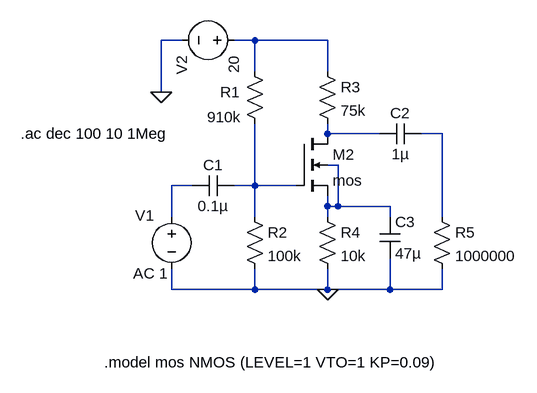
[diagram p0: schematic NNM24EE049_Jeethesh.asc]
NNM24EE049_Jeethesh.asc, the LTspice schematic file:
Version 4.1
SHEET 1 964 680
WIRE 16 -80 -16 -80
WIRE 128 -80 96 -80
WIRE 240 -80 128 -80
WIRE 128 -32 128 -80
WIRE 240 -32 240 -80
WIRE -16 0 -16 -80
WIRE 240 64 240 48
WIRE 320 64 240 64
WIRE 416 64 384 64
WIRE 256 112 240 112
WIRE 32 144 0 144
WIRE 128 144 128 48
WIRE 128 144 96 144
WIRE 192 144 128 144
WIRE 240 176 240 160
WIRE 256 176 256 112
WIRE 256 176 240 176
WIRE 336 176 256 176
WIRE 0 192 0 144
WIRE 128 192 128 144
WIRE 240 192 240 176
WIRE 336 192 336 176
WIRE 416 192 416 64
WIRE 0 304 0 272
WIRE 128 304 128 272
WIRE 128 304 0 304
WIRE 240 304 240 272
WIRE 240 304 128 304
WIRE 336 304 336 256
WIRE 336 304 240 304
WIRE 416 304 416 272
WIRE 416 304 336 304
FLAG 240 304 0
FLAG -16 0 0
SYMBOL res 112 -48 R0
WINDOW 0 -37 48 Left 2
WINDOW 3 -57 86 Left 2
SYMATTR InstName R1
SYMATTR Value 910k
SYMBOL res 112 176 R0
SYMATTR InstName R2
SYMATTR Value 100k
SYMBOL res 224 -48 R0
SYMATTR InstName R3
SYMATTR Value 75k
SYMBOL res 224 176 R0
SYMATTR InstName R4
SYMATTR Value 10k
SYMBOL res 400 176 R0
SYMATTR InstName R5
SYMATTR Value 1000000
SYMBOL cap 96 128 R90
WINDOW 0 0 32 VBottom 2
WINDOW 3 32 32 VTop 2
SYMATTR InstName C1
SYMATTR Value 0.1µ
SYMBOL cap 320 80 R270
WINDOW 0 32 32 VTop 2
WINDOW 3 0 32 VBottom 2
SYMATTR InstName C2
SYMATTR Value 1µ
SYMBOL voltage 0 176 R0
WINDOW 0 -56 14 Left 2
WINDOW 3 -200 106 Left 2
WINDOW 123 -59 103 Left 2
WINDOW 39 0 0 Left 0
SYMATTR InstName V1
SYMATTR Value ""
SYMATTR Value2 AC 1
SYMBOL voltage 112 -80 R90
WINDOW 0 24 96 Left 2
WINDOW 3 24 16 Left 2
WINDOW 123 0 0 Left 0
WINDOW 39 0 0 Left 0
SYMATTR InstName V2
SYMATTR Value 20
SYMBOL cap 320 192 R0
SYMATTR InstName C3
SYMATTR Value 47µ
SYMBOL nmos4 192 64 R0
SYMATTR InstName M2
SYMATTR Value mos
TEXT -232 64 Left 2 !.ac dec 100 10 1Meg
TEXT -104 416 Left 2 !.model mos NMOS (LEVEL=1 VTO=1 KP=0.09)

The netlist it stands for:
* NNM24EE049_Jeethesh.asc
R1 N001 N006 910k
R2 N006 0 100k
R3 N001 N002 75k
R4 N004 0 10k
R5 N003 0 1000000
C1 N006 N005 0.1µ
C2 N002 N003 1µ
V1 N005 0 AC 1
V2 N001 0 20
C3 N004 0 47µ
M2 N002 N006 N004 N004 mos
.model NMOS NMOS
.model PMOS PMOS
.lib standard.mos
.ac dec 100 10 1Meg
.model mos NMOS (LEVEL=1 VTO=1 KP=0.09)
.backanno
.end